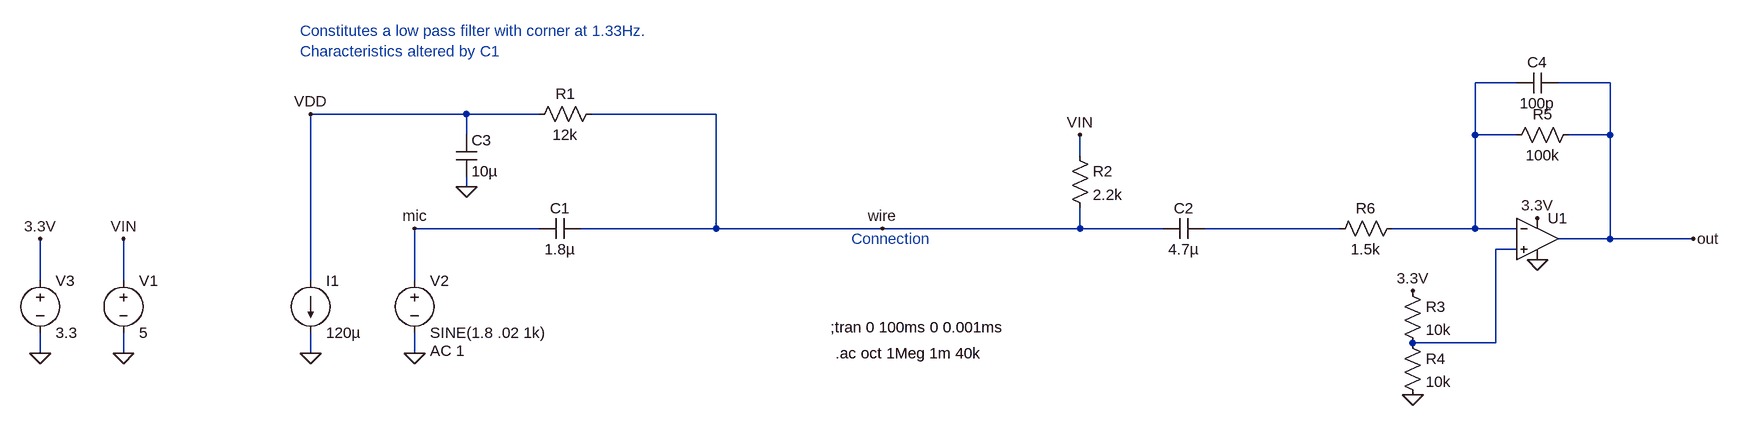
[diagram p0: schematic MIC Amplifier and Bias.asc]
MIC Amplifier and Bias.asc, the LTspice schematic file:
Version 4
SHEET 1 2288 680
WIRE 1952 -160 1888 -160
WIRE 2096 -160 2016 -160
WIRE 336 -112 96 -112
WIRE 448 -112 336 -112
WIRE 720 -112 528 -112
WIRE 336 -80 336 -112
WIRE 1888 -80 1888 -160
WIRE 1952 -80 1888 -80
WIRE 2096 -80 2096 -160
WIRE 2096 -80 2032 -80
WIRE 1280 -48 1280 -80
WIRE 336 0 336 -16
WIRE 448 64 256 64
WIRE 720 64 720 -112
WIRE 720 64 512 64
WIRE 976 64 720 64
WIRE 1280 64 1280 32
WIRE 1280 64 976 64
WIRE 1408 64 1280 64
WIRE 1680 64 1472 64
WIRE 1888 64 1888 -80
WIRE 1888 64 1760 64
WIRE 1952 64 1888 64
WIRE 2096 80 2096 -80
WIRE 2096 80 2016 80
WIRE 2224 80 2096 80
WIRE 1952 96 1920 96
WIRE -320 144 -320 80
WIRE -192 144 -192 80
WIRE 96 144 96 -112
WIRE 256 144 256 64
WIRE 1920 240 1920 96
WIRE 1920 240 1792 240
WIRE -320 256 -320 224
WIRE -192 256 -192 224
WIRE 96 256 96 224
WIRE 256 256 256 224
FLAG 96 256 0
FLAG 1280 -80 VIN
FLAG -192 80 VIN
FLAG -192 256 0
FLAG 2224 80 out
FLAG 256 256 0
FLAG 336 0 0
FLAG 96 -112 VDD
FLAG 976 64 wire
FLAG 256 64 mic
FLAG -320 80 3.3V
FLAG -320 256 0
FLAG 1984 48 3.3V
FLAG 1984 112 0
FLAG 1792 320 0
FLAG 1792 160 3.3V
DATAFLAG 208 -112 ""
DATAFLAG 816 64 ""
DATAFLAG 352 64 ""
DATAFLAG 2160 80 ""
SYMBOL current 96 144 R0
WINDOW 123 0 0 Left 2
WINDOW 39 0 0 Left 2
SYMATTR InstName I1
SYMATTR Value 120µ
SYMBOL res 544 -128 R90
WINDOW 0 0 56 VBottom 2
WINDOW 3 32 56 VTop 2
SYMATTR InstName R1
SYMATTR Value 12k
SYMBOL cap 512 80 M270
WINDOW 0 32 32 VTop 2
WINDOW 3 0 32 VBottom 2
SYMATTR InstName C1
SYMATTR Value 1.8µ
SYMBOL res 1264 -64 R0
SYMATTR InstName R2
SYMATTR Value 2.2k
SYMBOL voltage -192 128 R0
WINDOW 123 0 0 Left 2
WINDOW 39 0 0 Left 2
SYMATTR InstName V1
SYMATTR Value 5
SYMBOL cap 1472 48 R90
WINDOW 0 0 32 VBottom 2
WINDOW 3 32 32 VTop 2
SYMATTR InstName C2
SYMATTR Value 4.7µ
SYMBOL voltage 256 128 R0
WINDOW 123 24 124 Left 2
WINDOW 39 0 0 Left 2
SYMATTR Value2 AC 1
SYMATTR InstName V2
SYMATTR Value SINE(1.8 .02 1k)
SYMBOL cap 320 -80 R0
SYMATTR InstName C3
SYMATTR Value 10µ
SYMBOL Opamps\\UniversalOpamp2 1984 80 R0
SYMATTR InstName U1
SYMBOL voltage -320 128 R0
WINDOW 123 0 0 Left 2
WINDOW 39 0 0 Left 2
SYMATTR InstName V3
SYMATTR Value 3.3
SYMBOL res 1776 144 R0
SYMATTR InstName R3
SYMATTR Value 10k
SYMBOL res 1776 224 R0
SYMATTR InstName R4
SYMATTR Value 10k
SYMBOL res 2048 -96 R90
WINDOW 0 0 56 VBottom 2
WINDOW 3 32 56 VTop 2
SYMATTR InstName R5
SYMATTR Value 100k
SYMBOL cap 2016 -176 R90
WINDOW 0 0 32 VBottom 2
WINDOW 3 32 32 VTop 2
SYMATTR InstName C4
SYMATTR Value 100p
SYMBOL res 1776 48 R90
WINDOW 0 0 56 VBottom 2
WINDOW 3 32 56 VTop 2
SYMATTR InstName R6
SYMATTR Value 1.5k
TEXT 896 216 Left 2 !;tran 0 100ms 0 0.001ms
TEXT 904 256 Left 2 !.ac oct 1Meg 1m 40k
TEXT 80 -240 Left 2 ;Constitutes a low pass filter with corner at 1.33Hz.\nCharacteristics altered by C1
TEXT 928 80 Left 2 ;Connection

The netlist it stands for:
* MIC Amplifier and Bias.asc
I1 VDD 0 120µ
R1 wire VDD 12k
C1 wire mic 1.8µ
R2 VIN wire 2.2k
V1 VIN 0 5
C2 N002 wire 4.7µ
V2 mic 0 SINE(1.8 .02 1k) AC 1
C3 VDD 0 10µ
XU1 N003 N001 3.3V 0 out level.2 Avol=1Meg GBW=10Meg Slew=10Meg ilimit=25m rail=0 Vos=0 phimargin=45 en=0 enk=0 in=0 ink=0 Rin=500Meg  ; pins IN+ IN- V+ V- OUT
V3 3.3V 0 3.3
R3 3.3V N003 10k
R4 N003 0 10k
R5 out N001 100k
C4 out N001 100p
R6 N001 N002 1.5k
;tran 0 100ms 0 0.001ms
.ac oct 1Meg 1m 40k
* Constitutes a low pass filter with corner at 1.33Hz.
* Characteristics altered by C1
* Connection
.lib UniversalOpamps2.sub
.backanno
.end